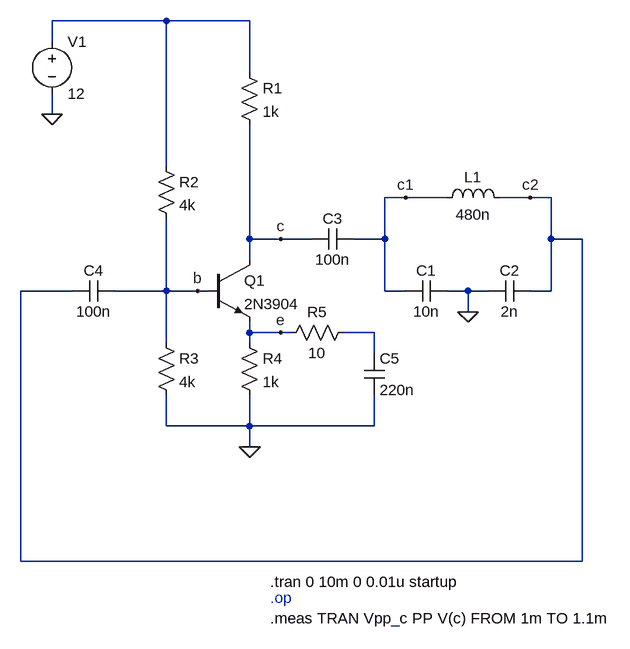
[diagram p0: schematic basic_colpitts_canonical.asc]
basic_colpitts_canonical.asc, the LTspice schematic file:
Version 4
SHEET 1 1412 680
WIRE 464 -400 288 -400
WIRE 592 -400 464 -400
WIRE 288 -368 288 -400
WIRE 592 -320 592 -400
WIRE 288 -256 288 -288
WIRE 464 -176 464 -400
WIRE 832 -128 800 -128
WIRE 896 -128 832 -128
WIRE 1024 -128 976 -128
WIRE 1056 -128 1024 -128
WIRE 592 -64 592 -240
WIRE 640 -64 592 -64
WIRE 688 -64 640 -64
WIRE 800 -64 800 -128
WIRE 800 -64 752 -64
WIRE 1056 -64 1056 -128
WIRE 1104 -64 1056 -64
WIRE 592 -32 592 -64
WIRE 320 16 240 16
WIRE 464 16 464 -96
WIRE 464 16 384 16
WIRE 512 16 464 16
WIRE 528 16 512 16
WIRE 800 16 800 -64
WIRE 832 16 800 16
WIRE 928 16 896 16
WIRE 960 16 928 16
WIRE 1056 16 1056 -64
WIRE 1056 16 1024 16
WIRE 928 48 928 16
WIRE 592 80 592 64
WIRE 640 80 592 80
WIRE 656 80 640 80
WIRE 784 80 736 80
WIRE 464 96 464 16
WIRE 592 96 592 80
WIRE 784 112 784 80
WIRE 464 224 464 176
WIRE 592 224 592 176
WIRE 592 224 464 224
WIRE 784 224 784 176
WIRE 784 224 592 224
WIRE 592 256 592 224
WIRE 240 432 240 16
WIRE 1104 432 1104 -64
WIRE 1104 432 240 432
FLAG 592 256 0
FLAG 288 -256 0
FLAG 832 -128 c1
FLAG 1024 -128 c2
FLAG 928 48 0
FLAG 512 16 b
FLAG 640 -64 c
FLAG 640 80 e
SYMBOL cap 832 32 R270
WINDOW 0 32 32 VTop 2
WINDOW 3 0 32 VBottom 2
SYMATTR InstName C1
SYMATTR Value 10n
SYMBOL cap 1024 0 R90
WINDOW 0 0 32 VBottom 2
WINDOW 3 32 32 VTop 2
SYMATTR InstName C2
SYMATTR Value 2n
SYMBOL ind 880 -112 R270
WINDOW 0 32 56 VTop 2
WINDOW 3 5 56 VBottom 2
SYMATTR InstName L1
SYMATTR Value 480n
SYMBOL npn 528 -32 R0
SYMATTR InstName Q1
SYMATTR Value 2N3904
SYMBOL res 576 -336 R0
SYMATTR InstName R1
SYMATTR Value 1k
SYMBOL voltage 288 -384 R0
WINDOW 123 0 0 Left 0
WINDOW 39 0 0 Left 0
SYMATTR InstName V1
SYMATTR Value 12
SYMBOL cap 752 -80 R90
WINDOW 0 0 32 VBottom 2
WINDOW 3 32 32 VTop 2
SYMATTR InstName C3
SYMATTR Value 100n
SYMBOL cap 384 0 R90
WINDOW 0 0 32 VBottom 2
WINDOW 3 32 32 VTop 2
SYMATTR InstName C4
SYMATTR Value 100n
SYMBOL res 448 -192 R0
SYMATTR InstName R2
SYMATTR Value 4k
SYMBOL res 448 80 R0
SYMATTR InstName R3
SYMATTR Value 4k
SYMBOL res 576 80 R0
SYMATTR InstName R4
SYMATTR Value 1k
SYMBOL cap 768 112 R0
SYMATTR InstName C5
SYMATTR Value 220n
SYMBOL res 752 64 R90
WINDOW 0 0 56 VBottom 2
WINDOW 3 32 56 VTop 2
SYMATTR InstName R5
SYMATTR Value 10
TEXT 624 464 Left 2 !.tran 0 10m 0 0.01u startup
TEXT 624 488 Left 2 ;.op
TEXT 624 520 Left 2 !.meas TRAN Vpp_c PP V(c) FROM 1m TO 1.1m

The netlist it stands for:
* basic_colpitts_canonical.asc
C1 c1 0 10n
C2 c2 0 2n
L1 c1 c2 480n
Q1 c b e 0 2N3904
R1 N001 c 1k
V1 N001 0 12
C3 c1 c 100n
C4 b c2 100n
R2 N001 b 4k
R3 b 0 4k
R4 e 0 1k
C5 N002 0 220n
R5 N002 e 10
.model NPN NPN
.model PNP PNP
.lib standard.bjt
.tran 0 10m 0 0.01u startup
* .op
.meas TRAN Vpp_c PP V(c) FROM 1m TO 1.1m
.backanno
.end